# Altium schematic sheet Sensors.SchDoc: Sensors
size A3; SheetNumber: 9; SheetTotal: 10
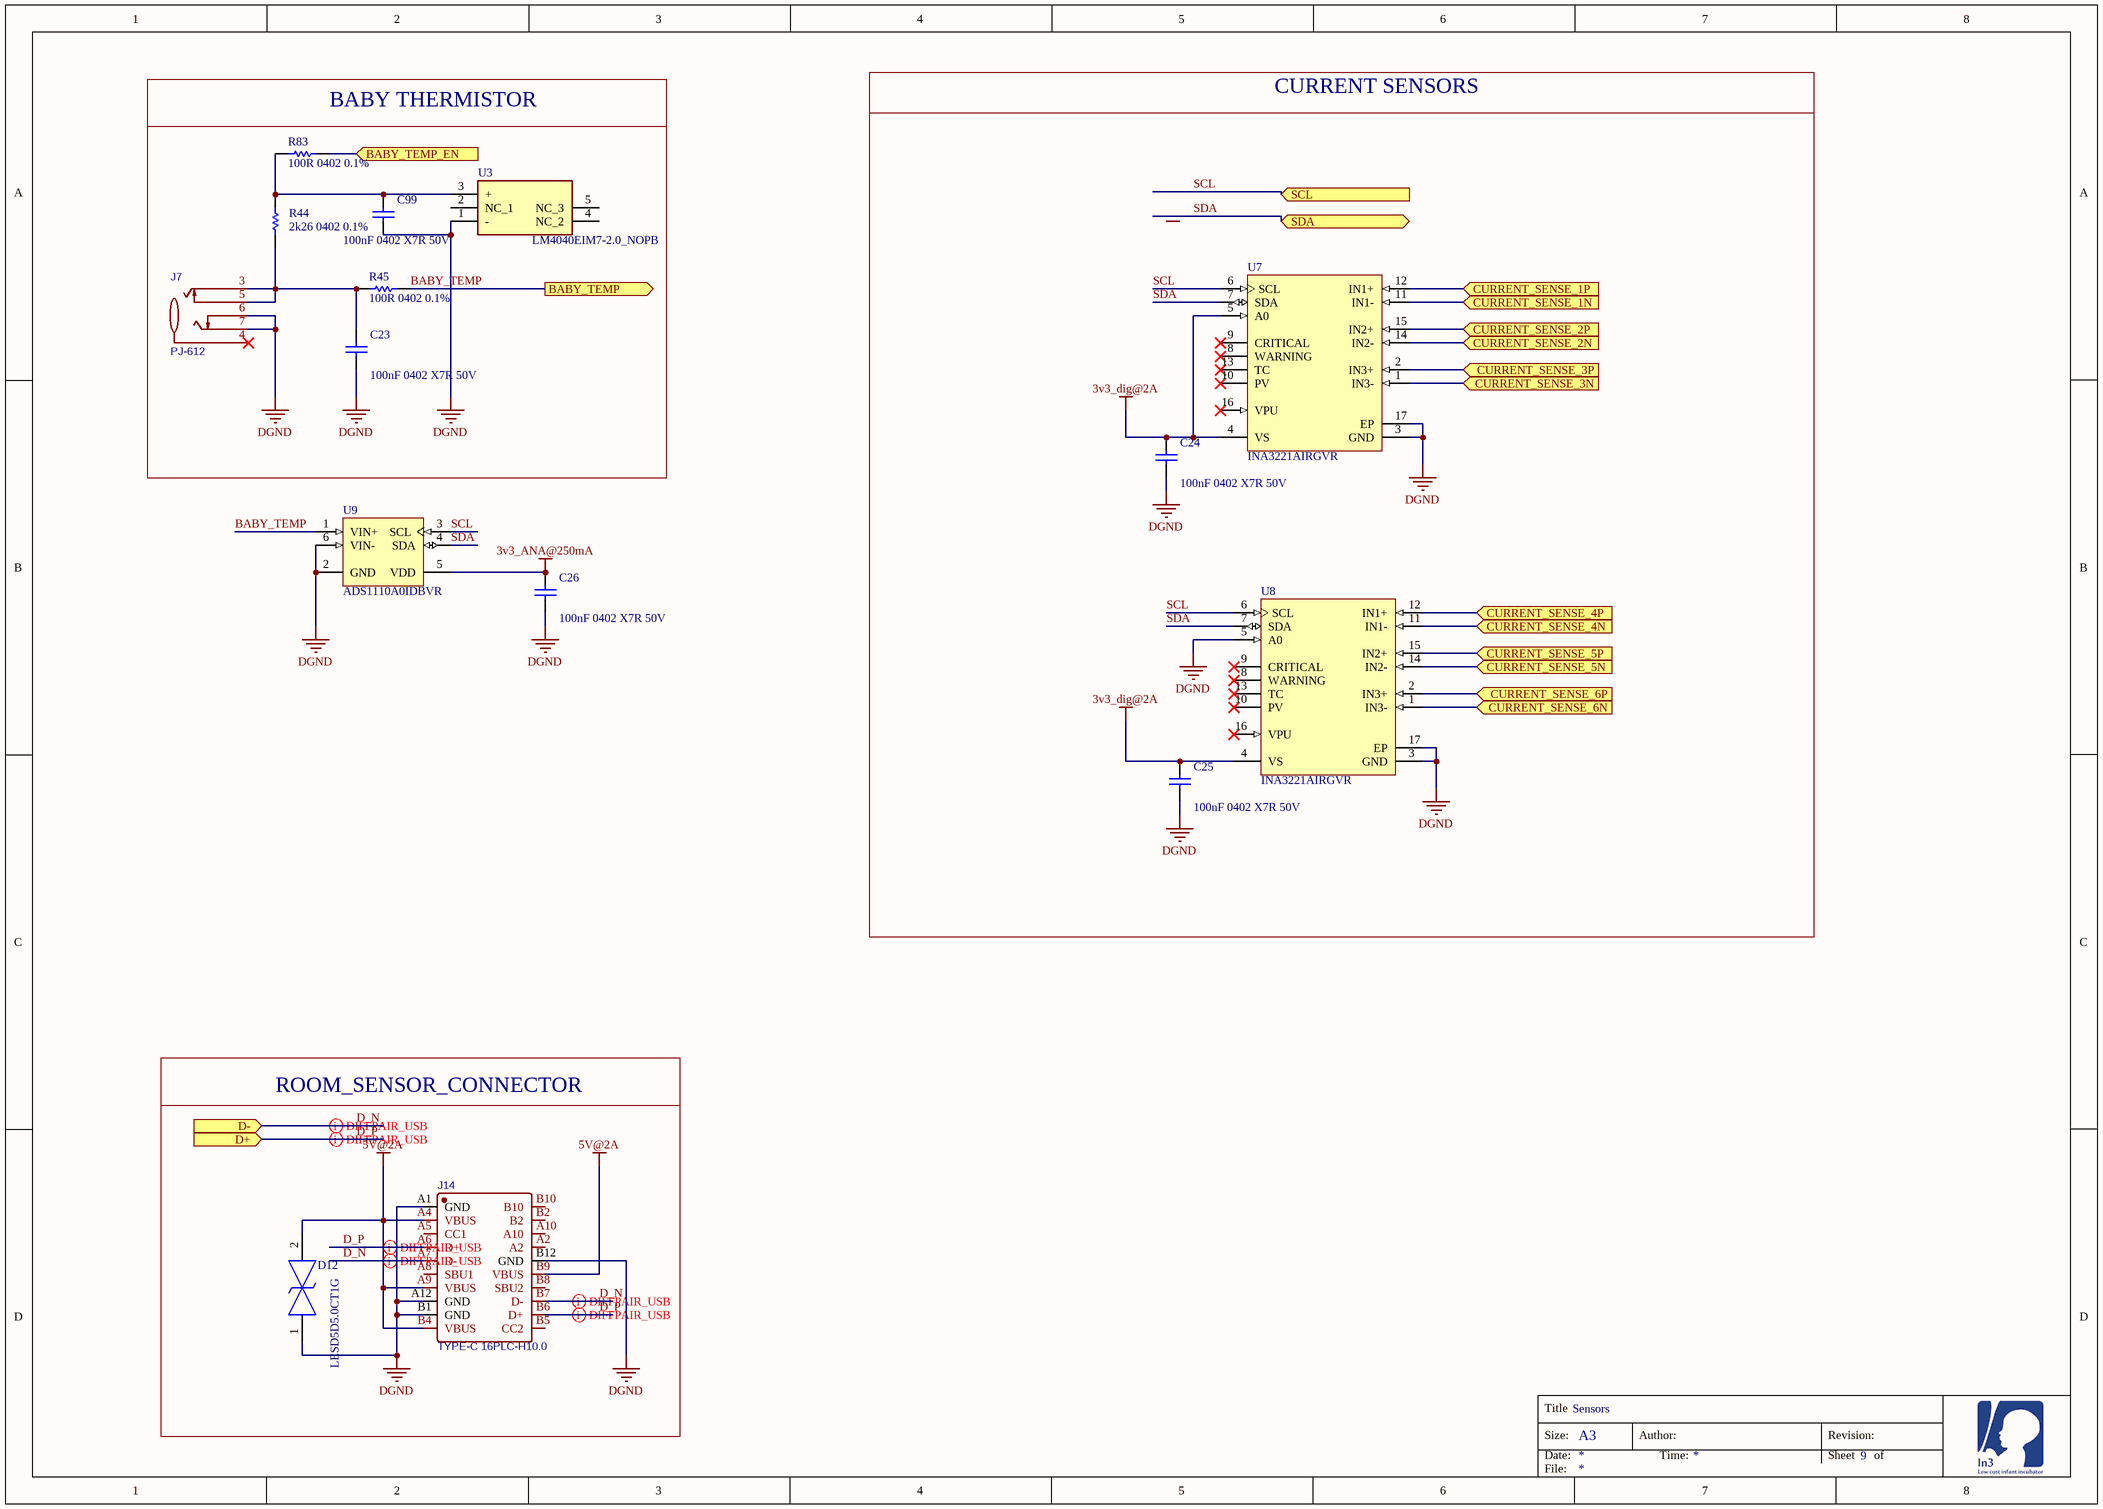
[diagram p0: Sensors.SchDoc]

## Parts
C23  100nF 0402 X7R 50V  [CAPC1005X55X25NL5T10]
C24  100nF 0402 X7R 50V  [CAPC1005X55X25NL5T10]
C25  100nF 0402 X7R 50V  [CAPC1005X55X25NL5T10]
C26  100nF 0402 X7R 50V  [CAPC1005X55X25NL5T10]
C99  100nF 0402 X7R 50V  [CAPC1005X55X25NL5T10]
D12  LESD5D5.0CT1G  [LESD5D50CT1G]
J7  PJ-612  [AUDIO-TH_PJ-612]
J14  TYPE-C 16PLC-H10.0  [TYPE-C-TH_16PLC-H10.0]
R44  2k26 0402 0.1%  [RESC1005X40X25ML05T10]
R45  100R 0402 0.1%  [RESC1005X40X25ML05T10]
R83  100R 0402 0.1%  [RESC1005X40X25ML05T10]
U3  LM4040EIM7-2.0_NOPB  [SOT65P210X110-5N]
U7  INA3221AIRGVR  [RGV0016A_V]
U8  INA3221AIRGVR  [RGV0016A_V]
U9  ADS1110A0IDBVR  [TI-DBV6_M]

## Blocks framed on the sheet
BABY THERMISTOR: C23 C99 J7 R44 R45 R83 U3
CURRENT SENSORS: C24 C25 U7 U8
ROOM_SENSOR_CONNECTOR: D12 J14

## Ports
BABY_TEMP (out), BABY_TEMP_EN (in), CURRENT_SENSE_1N (in), CURRENT_SENSE_1P (in), CURRENT_SENSE_2N (in), CURRENT_SENSE_2P (in), CURRENT_SENSE_3N (in), CURRENT_SENSE_3P (in), CURRENT_SENSE_4N (in), CURRENT_SENSE_4P (in), CURRENT_SENSE_5N (in), CURRENT_SENSE_5P (in), CURRENT_SENSE_6N (in), CURRENT_SENSE_6P (in), D+ (in), D- (in), SCL (in), SDA (bidir)

## Nets
3v3_ANA@250mA: C26.2 U9.5(VDD)
3v3_dig@2A: C24.2 C25.2 U7.4(VS) U7.5(A0) U8.4(VS)
5V@2A: D12.2 J14.A4(VBUS) J14.A9(VBUS) J14.B4(VBUS) J14.B9(VBUS)
DGND: C23.1 C24.1 C25.1 C26.1 C99.1 D12.1 J7.6 J7.7 J14.A1(GND) J14.A12(GND) J14.B1(GND) J14.B12(GND) U3.1(-) U7.3(GND) U7.17(EP) U8.3(GND) U8.5(A0) U8.17(EP) U9.2(GND) U9.6(VIN-)
BABY_TEMP: R45.2 U9.1(VIN+) ; port BABY_TEMP
BABY_TEMP_EN: R83.2 ; port BABY_TEMP_EN
CURRENT_SENSE_1N: U7.11(IN1-) ; port CURRENT_SENSE_1N
CURRENT_SENSE_1P: U7.12(IN1+) ; port CURRENT_SENSE_1P
CURRENT_SENSE_2N: U7.14(IN2-) ; port CURRENT_SENSE_2N
CURRENT_SENSE_2P: U7.15(IN2+) ; port CURRENT_SENSE_2P
CURRENT_SENSE_3N: U7.1(IN3-) ; port CURRENT_SENSE_3N
CURRENT_SENSE_3P: U7.2(IN3+) ; port CURRENT_SENSE_3P
CURRENT_SENSE_4N: U8.11(IN1-) ; port CURRENT_SENSE_4N
CURRENT_SENSE_4P: U8.12(IN1+) ; port CURRENT_SENSE_4P
CURRENT_SENSE_5N: U8.14(IN2-) ; port CURRENT_SENSE_5N
CURRENT_SENSE_5P: U8.15(IN2+) ; port CURRENT_SENSE_5P
CURRENT_SENSE_6N: U8.1(IN3-) ; port CURRENT_SENSE_6N
CURRENT_SENSE_6P: U8.2(IN3+) ; port CURRENT_SENSE_6P
D_N: J14.A7(D-) J14.B7(D-) ; port D-
D_P: J14.A6(D+) J14.B6(D+) ; port D+
SCL: U7.6(SCL) U8.6(SCL) U9.3(SCL) ; port SCL
SDA: U7.7(SDA) U8.7(SDA) U9.4(SDA) ; port SDA
NetC23_2: C23.2 J7.3 J7.5 R44.1 R45.1
NetC99_2: C99.2 R44.2 R83.1 U3.3(+)

Not connected (* = marked no-connect by the designer): J7 4*; J14 A2 A5(CC1) A8(SBU1) A10 B2 B5(CC2) B8(SBU2) B10; U3 2(NC_1) 4(NC_2) 5(NC_3); U7 8(WARNING)* 9(CRITICAL)* 10(PV)* 13(TC)* 16(VPU)*; U8 8(WARNING)* 9(CRITICAL)* 10(PV)* 13(TC)* 16(VPU)*

## Layout directives
differential pair; differential pair class USB: D_N, D_P

## Notes on the sheet
- Title
- Size:
- Date:
- A3
- Author:
- Time:
- Revision:
- Sheet
- of
- File:

## Library data of the parts
C23-C26 C99 = CMP-1662-00020-1: ComponentLink2Description: Datasheet; ComponentLink2URL: http://psearch.en.murata.com/capacitor/product/GRM155R60J105KE19%23.pdf; ComponentLink1Description: Manufacturer URL; ComponentLink1URL: http://www.murata.com/; LCSC_PN: C77020
D12 = LESD5D5.0CT1G: TVS Diode (Bi-directional); Manufacturer_Name: LRC; Height: 0.7mm; Manufacturer_Part_Number: LESD5D5.0CT1G; LCSC_PN: C383211
J7 = PJ-612: Manufacturer: HOOYA(皓宇电子); Contributor: LCSC; Supplier: LCSC; Supplier Part: C309284; Manufacturer Part: PJ-612; JLCPCB Part Class: Extended Part; spicePre: J; spiceSymbolName: PJ-612; LCSC_PN: C309284
J14 = TYPE-C 16PLC-H10.0: Manufacturer: SHOU HAN(首韩); Contributor: lcsc; Supplier: LCSC; Supplier Part: C3151747; Manufacturer Part: TYPE-C 16PLC-H10.0; JLCPCB Part Class: Extended Part; spicePre: U; spiceSymbolName: TYPE-C 16PLC-H10.0; LCSC_PN: C3151747
R44 R45 R83 = CMP-2002-07472-1
  R44: LCSC_PN: C852697
  R45 R83: LCSC_PN: C106233
U3 = LM4040EIM7-2.0_NOPB: Integrated Circuit; Manufacturer_Name: Texas Instruments; Manufacturer_Part_Number: LM4040EIM7-2.0/NOPB; Datasheet Link: http://www.ti.com/lit/ds/symlink/lm4040-n.pdf; Height: 1.1mm; Mouser Part Number: 595-M4040EIM7-2.0NPB; Mouser Price/Stock: https://www.mouser.co.uk/ProductDetail/Texas-Instruments/LM4040EIM7-2.0-NOPB?qs=2k4gZbgf%2F9k9BIpEqTAQVA%3D%3D; Arrow Part Number: LM4040EIM7-2.0/NOPB; Arrow Price/Stock: https://www.arrow.com/en/products/lm4040eim7-2.0nopb/texas-instruments; LCSC_PN: C1848440
U7 U8 = CMP-0704-00001-2: Triple Channel Shunt and Bus Voltage Monitor, 120 dB, 2.7 to 5.5 V, -40 to 125 degC, 16-Pin VQFN (RGV), Green (RoHS & no Sb/Br), Tape and Reel; Manufacturer: Texas Instruments; Rating: Catalog; Quiescent Current (Typ): 350 uA; Gain Error (max): 0.25%; CMR (Typ): 120 dB; Offset Voltage (max): +/- 80 uV; Gain: 1 V/V; Voltage Input Range (Bus): 0 to 26 V; ComponentLink2Description: Datasheet; PackageDescription: 16-Pin Quad Flat No-lead Package, Body 4 x 4 mm, Pitch 0.65 mm; ComponentLink3URL: http://www.ti.com/lit/ds/symlink/ina3221.pdf; PartNumber: INA3221AIRGVR; Operating Supply Range: 2.7 to 5.5 V; DatasheetVersion: SBOS576A; Temperature Range: -40 to 125 degC; ComponentLink1Description: Manufacturer URL; ComponentLink1URL: http://www.ti.com/; RoHS: TRUE; ComponentLink3Description: Package Specification; Packing: Tape and Reel; Mounting Technology: Surface Mount; ComponentLink2URL: http://www.ti.com/lit/ds/symlink/ina3221.pdf; PackageVersion: SBOS576A; PackageReference: RGV0016A; LCSC_PN: C181255
U9 = CMP-0003-00257-2: 16-Bit Delta-Sigma ADC with Internal Reference, PGA and Oscillator, I2C Serial Interface, -40 to 85 degC, 6-pin SOT23 (DBV6), Green (RoHS & no Sb/Br); Manufacturer: Texas Instruments; # Input Channels: 1; Digital Supply(Max)(V): 5.5; Resolution(Bits): 16; Interface: Serial I2C; Digital Supply(Min)(V): 2.7; SubFamily: Precision ADC (<=10MSPS); Sample Rate (max)(SPS): 240; Mounting Technology: Surface Mount; PackageDescription: 6-Pin Plastic Small Outline, Body 1.6 x 2.9 mm, Pitch 0.95 mm; ComponentLink3URL: http://www.ti.com/litv/pdf/mpds026h; ComponentLink1Description: Manufacturer URL; PackageReference: DBV6; ComponentLink1URL: http://www.ti.com/; Eco-Plan: Green (RoHS & no Sb/Br); ComponentLink2URL: http://www.ti.com/general/docs/lit/getliterature.tsp?genericPartNumber=ADS1110&fileType=pdf; Analog Voltage AV/DD(Min)(V): 2.7; ComponentLink2Description: Datasheet; PartNumber: ADS1110A0IDBVR; ComponentLink3Description: Package Specification; PackageVersion: 4073253-5/K, 03/2006; Analog Voltage AV/DD(Max)(V): 5.5; Architecture: Delta-Sigma; Code_JEDEC: MO-178; DatasheetVersion: SBAS276A; LCSC_PN: C16598